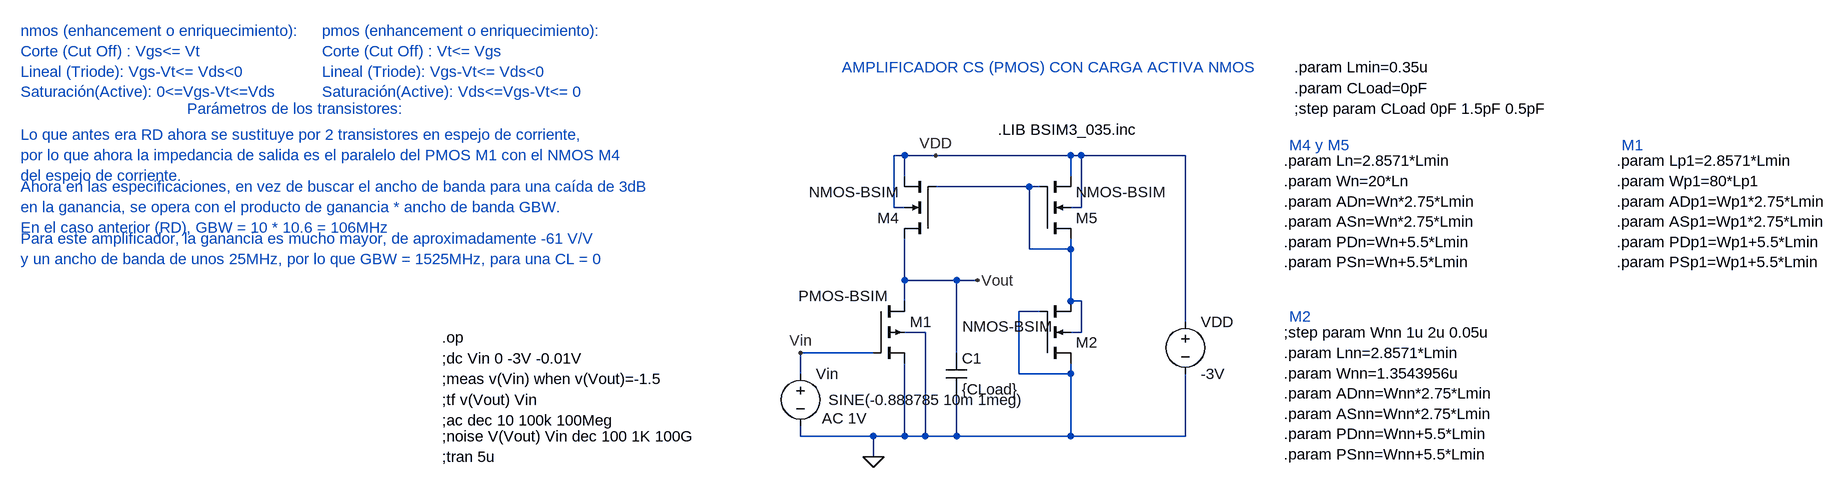
[diagram p0: schematic PMOS_CS_CMOSLOAD.asc]
PMOS_CS_CMOSLOAD.asc, the LTspice schematic file:
Version 4
SHEET 1 1644 984
WIRE 48 368 32 368
WIRE 96 368 48 368
WIRE 304 368 96 368
WIRE 320 368 304 368
WIRE 480 368 320 368
WIRE 48 400 48 368
WIRE 304 400 304 368
WIRE 240 416 96 416
WIRE 256 416 240 416
WIRE 32 448 32 368
WIRE 48 448 32 448
WIRE 320 448 320 368
WIRE 320 448 304 448
WIRE 240 512 240 416
WIRE 304 512 304 496
WIRE 304 512 240 512
WIRE 48 560 48 496
WIRE 128 560 48 560
WIRE 160 560 128 560
WIRE 48 592 48 560
WIRE 304 592 304 512
WIRE 320 592 304 592
WIRE 256 608 224 608
WIRE 480 624 480 368
WIRE 80 640 48 640
WIRE 320 640 320 592
WIRE 320 640 304 640
WIRE 0 672 -112 672
WIRE 128 672 128 560
WIRE -112 704 -112 672
WIRE 224 704 224 608
WIRE 304 704 304 688
WIRE 304 704 224 704
WIRE -112 800 -112 784
WIRE 0 800 -112 800
WIRE 48 800 48 688
WIRE 48 800 0 800
WIRE 80 800 80 640
WIRE 80 800 48 800
WIRE 128 800 128 736
WIRE 128 800 80 800
WIRE 304 800 304 704
WIRE 304 800 128 800
WIRE 480 800 480 704
WIRE 480 800 304 800
WIRE 0 832 0 800
FLAG 0 832 0
FLAG -112 672 Vin
FLAG 96 368 VDD
FLAG 160 560 Vout
SYMBOL voltage -112 688 R0
WINDOW 123 33 85 Left 2
WINDOW 39 0 0 Left 2
WINDOW 3 43 56 Left 2
SYMATTR Value2 AC 1V
SYMATTR Value SINE(-0.888785 10m 1meg)
SYMATTR InstName Vin
SYMBOL voltage 480 608 R0
WINDOW 123 0 0 Left 0
WINDOW 39 0 0 Left 0
SYMATTR InstName VDD
SYMATTR Value -3V
SYMBOL pmos4 0 592 R0
WINDOW 3 -115 -8 Left 2
SYMATTR Value PMOS-BSIM
SYMATTR InstName M1
SYMATTR Value2 l={Lp1} w={Wp1} ad={ADp1} as={ASp1} pd={PDp1} ps={PSp1} m=1
SYMBOL nmos4 96 496 R180
SYMATTR InstName M4
SYMATTR Value NMOS-BSIM
SYMATTR Value2 l={Ln} w={Wn} ad={ADn} as={ASn} pd={PDn} ps={PSn} m=1
SYMBOL nmos4 256 496 M180
SYMATTR InstName M5
SYMATTR Value NMOS-BSIM
SYMATTR Value2 l={Ln} w={Wn} ad={ADn} as={ASn} pd={PDn} ps={PSn} m=1
SYMBOL nmos4 256 688 M180
WINDOW 3 -119 57 Left 2
SYMATTR Value NMOS-BSIM
SYMATTR InstName M2
SYMATTR Value2 l={Lnn} w={Wnn} ad={ADnn} as={ASnn} pd={PDnn} ps={PSnn} m=1
SYMBOL cap 112 672 R0
SYMATTR InstName C1
SYMATTR Value {CLoad}
TEXT -48 232 Left 2 ;AMPLIFICADOR CS (PMOS) CON CARGA ACTIVA NMOS
TEXT 1144 376 Left 2 !.param Lp1=2.8571*Lmin\n.param Wp1=80*Lp1\n.param ADp1=Wp1*2.75*Lmin\n.param ASp1=Wp1*2.75*Lmin\n.param PDp1=Wp1+5.5*Lmin\n.param PSp1=Wp1+5.5*Lmin
TEXT 648 232 Left 2 !.param Lmin=0.35u
TEXT -664 744 Left 2 !;tf v(Vout) Vin
TEXT -664 680 Left 2 !;dc Vin 0 -3V -0.01V
TEXT 192 328 Left 2 !.LIB BSIM3_035.inc
TEXT -664 648 Left 2 !.op
TEXT -1056 296 Left 2 ;Parámetros de los transistores:
TEXT -664 712 Left 2 !;meas v(Vin) when v(Vout)=-1.5
TEXT -848 176 Left 2 ;pmos (enhancement o enriquecimiento):\nCorte (Cut Off) : Vt<= Vgs\nLineal (Triode): Vgs-Vt<= Vds<0\nSaturación(Active): Vds<=Vgs-Vt<= 0
TEXT -1312 336 Left 2 ;Lo que antes era RD ahora se sustituye por 2 transistores en espejo de corriente,\npor lo que ahora la impedancia de salida es el paralelo del PMOS M1 con el NMOS M4\ndel espejo de corriente.
TEXT -1312 416 Left 2 ;Ahora en las especificaciones, en vez de buscar el ancho de banda para una caída de 3dB\nen la ganancia, se opera con el producto de ganancia * ancho de banda GBW.\nEn el caso anterior (RD), GBW = 10 * 10.6 = 106MHz
TEXT 632 376 Left 2 !.param Ln=2.8571*Lmin\n.param Wn=20*Ln\n.param ADn=Wn*2.75*Lmin\n.param ASn=Wn*2.75*Lmin\n.param PDn=Wn+5.5*Lmin\n.param PSn=Wn+5.5*Lmin
TEXT -1312 176 Left 2 ;nmos (enhancement o enriquecimiento):\nCorte (Cut Off) : Vgs<= Vt\nLineal (Triode): Vgs-Vt<= Vds<0\nSaturación(Active): 0<=Vgs-Vt<=Vds
TEXT -664 800 Left 2 !;noise V(Vout) Vin dec 100 1K 100G
TEXT -664 776 Left 2 !;ac dec 10 100k 100Meg
TEXT -1312 496 Left 2 ;Para este amplificador, la ganancia es mucho mayor, de aproximadamente -61 V/V\ny un ancho de banda de unos 25MHz, por lo que GBW = 1525MHz, para una CL = 0
TEXT 632 640 Left 2 !;step param Wnn 1u 2u 0.05u
TEXT 632 672 Left 2 !.param Lnn=2.8571*Lmin\n.param Wnn=1.3543956u\n.param ADnn=Wnn*2.75*Lmin\n.param ASnn=Wnn*2.75*Lmin\n.param PDnn=Wnn+5.5*Lmin\n.param PSnn=Wnn+5.5*Lmin
TEXT 640 352 Left 2 ;M4 y M5
TEXT 1152 352 Left 2 ;M1
TEXT 640 616 Left 2 ;M2
TEXT 648 264 Left 2 !.param CLoad=0pF
TEXT 648 296 Left 2 !;step param CLoad 0pF 1.5pF 0.5pF
TEXT -664 832 Left 2 !;tran 5u

The netlist it stands for:
* PMOS_CS_CMOSLOAD.asc
Vin Vin 0 SINE(-0.888785 10m 1meg) AC 1V
VDD VDD 0 -3V
M1 Vout Vin 0 0 PMOS-BSIM l={Lp1} w={Wp1} ad={ADp1} as={ASp1} pd={PDp1} ps={PSp1} m=1
M4 Vout N001 VDD VDD NMOS-BSIM l={Ln} w={Wn} ad={ADn} as={ASn} pd={PDn} ps={PSn} m=1
M5 N001 N001 VDD VDD NMOS-BSIM l={Ln} w={Wn} ad={ADn} as={ASn} pd={PDn} ps={PSn} m=1
M2 0 0 N001 N001 NMOS-BSIM l={Lnn} w={Wnn} ad={ADnn} as={ASnn} pd={PDnn} ps={PSnn} m=1
C1 Vout 0 {CLoad}
.model NMOS NMOS
.model PMOS PMOS
.lib standard.mos
* AMPLIFICADOR CS (PMOS) CON CARGA ACTIVA NMOS
.param Lp1=2.8571*Lmin
.param Wp1=80*Lp1
.param ADp1=Wp1*2.75*Lmin
.param ASp1=Wp1*2.75*Lmin
.param PDp1=Wp1+5.5*Lmin
.param PSp1=Wp1+5.5*Lmin
.param Lmin=0.35u
;tf v(Vout) Vin
;dc Vin 0 -3V -0.01V
.LIB BSIM3_035.inc
.op
* Parámetros de los transistores:
;meas v(Vin) when v(Vout)=-1.5
* pmos (enhancement o enriquecimiento):
* Corte (Cut Off) : Vt<= Vgs
* Lineal (Triode): Vgs-Vt<= Vds<0
* Saturación(Active): Vds<=Vgs-Vt<= 0
* Lo que antes era RD ahora se sustituye por 2 transistores en espejo de corriente,
* por lo que ahora la impedancia de salida es el paralelo del PMOS M1 con el NMOS M4
* del espejo de corriente.
* Ahora en las especificaciones, en vez de buscar el ancho de banda para una caída de 3dB
* en la ganancia, se opera con el producto de ganancia * ancho de banda GBW.
* En el caso anterior (RD), GBW = 10 * 10.6 = 106MHz
.param Ln=2.8571*Lmin
.param Wn=20*Ln
.param ADn=Wn*2.75*Lmin
.param ASn=Wn*2.75*Lmin
.param PDn=Wn+5.5*Lmin
.param PSn=Wn+5.5*Lmin
* nmos (enhancement o enriquecimiento):
* Corte (Cut Off) : Vgs<= Vt
* Lineal (Triode): Vgs-Vt<= Vds<0
* Saturación(Active): 0<=Vgs-Vt<=Vds
;noise V(Vout) Vin dec 100 1K 100G
;ac dec 10 100k 100Meg
* Para este amplificador, la ganancia es mucho mayor, de aproximadamente -61 V/V
* y un ancho de banda de unos 25MHz, por lo que GBW = 1525MHz, para una CL = 0
;step param Wnn 1u 2u 0.05u
.param Lnn=2.8571*Lmin
.param Wnn=1.3543956u
.param ADnn=Wnn*2.75*Lmin
.param ASnn=Wnn*2.75*Lmin
.param PDnn=Wnn+5.5*Lmin
.param PSnn=Wnn+5.5*Lmin
* M4 y M5
* M1
* M2
.param CLoad=0pF
;step param CLoad 0pF 1.5pF 0.5pF
;tran 5u
.backanno
.end